# Altium schematic sheet PCB.SchDoc
size A4
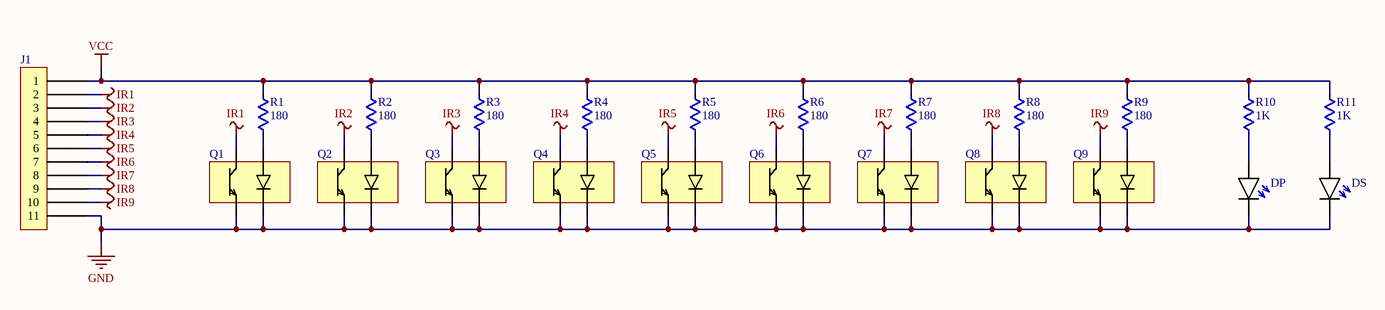
[diagram p0: PCB.SchDoc]

## Parts
DP  LED  [LED-3MM-RED]  (value not drawn)
DS  LED  [LED-3MM-GREEN]  (value not drawn)
J1  Header 1x11  [Header 1x11]  (value not drawn)
Q1  QRE1113GR  [QRE1113GR]  (value not drawn)
Q2  QRE1113GR  [QRE1113GR]  (value not drawn)
Q3  QRE1113GR  [QRE1113GR]  (value not drawn)
Q4  QRE1113GR  [QRE1113GR]  (value not drawn)
Q5  QRE1113GR  [QRE1113GR]  (value not drawn)
Q6  QRE1113GR  [QRE1113GR]  (value not drawn)
Q7  QRE1113GR  [QRE1113GR]  (value not drawn)
Q8  QRE1113GR  [QRE1113GR]  (value not drawn)
Q9  QRE1113GR  [QRE1113GR]  (value not drawn)
R1  value 180  [R1206]  (hidden comment: RES)
R2  value 180  [R1206]  (hidden comment: RES)
R3  value 180  [R1206]  (hidden comment: RES)
R4  value 180  [R1206]  (hidden comment: RES)
R5  value 180  [R1206]  (hidden comment: RES)
R6  value 180  [R1206]  (hidden comment: RES)
R7  value 180  [R1206]  (hidden comment: RES)
R8  value 180  [R1206]  (hidden comment: RES)
R9  value 180  [R1206]  (hidden comment: RES)
R10  value 1K  [R1206]  (hidden comment: RES)
R11  value 1K  [R1206]  (hidden comment: RES)

## Nets
GND: DP.K DS.K J1.11 Q1.E Q1.K Q2.E Q2.K Q3.E Q3.K Q4.E Q4.K Q5.E Q5.K Q6.E Q6.K Q7.E Q7.K Q8.E Q8.K Q9.E Q9.K
IR1: J1.2 Q1.C
IR2: J1.3 Q2.C
IR3: J1.4 Q3.C
IR4: J1.5 Q4.C
IR5: J1.6 Q5.C
IR6: J1.7 Q6.C
IR7: J1.8 Q7.C
IR8: J1.9 Q8.C
IR9: J1.10 Q9.C
VCC: J1.1 R1.2 R2.2 R3.2 R4.2 R5.2 R6.2 R7.2 R8.2 R9.2 R10.2 R11.2
NetDP_A: DP.A R10.1
NetDS_A: DS.A R11.1
NetQ1_A: Q1.A R1.1
NetQ2_A: Q2.A R2.1
NetQ3_A: Q3.A R3.1
NetQ4_A: Q4.A R4.1
NetQ5_A: Q5.A R5.1
NetQ6_A: Q6.A R6.1
NetQ7_A: Q7.A R7.1
NetQ8_A: Q8.A R8.1
NetQ9_A: Q9.A R9.1

## Library data of the parts
Q1-Q9 = QRE1113GR: MF: ON Semiconductor; Price: 0.46 USD; MP: QRE1113GR; Package: SMD-4 ON Semiconductor; Availability: Good; Value: *